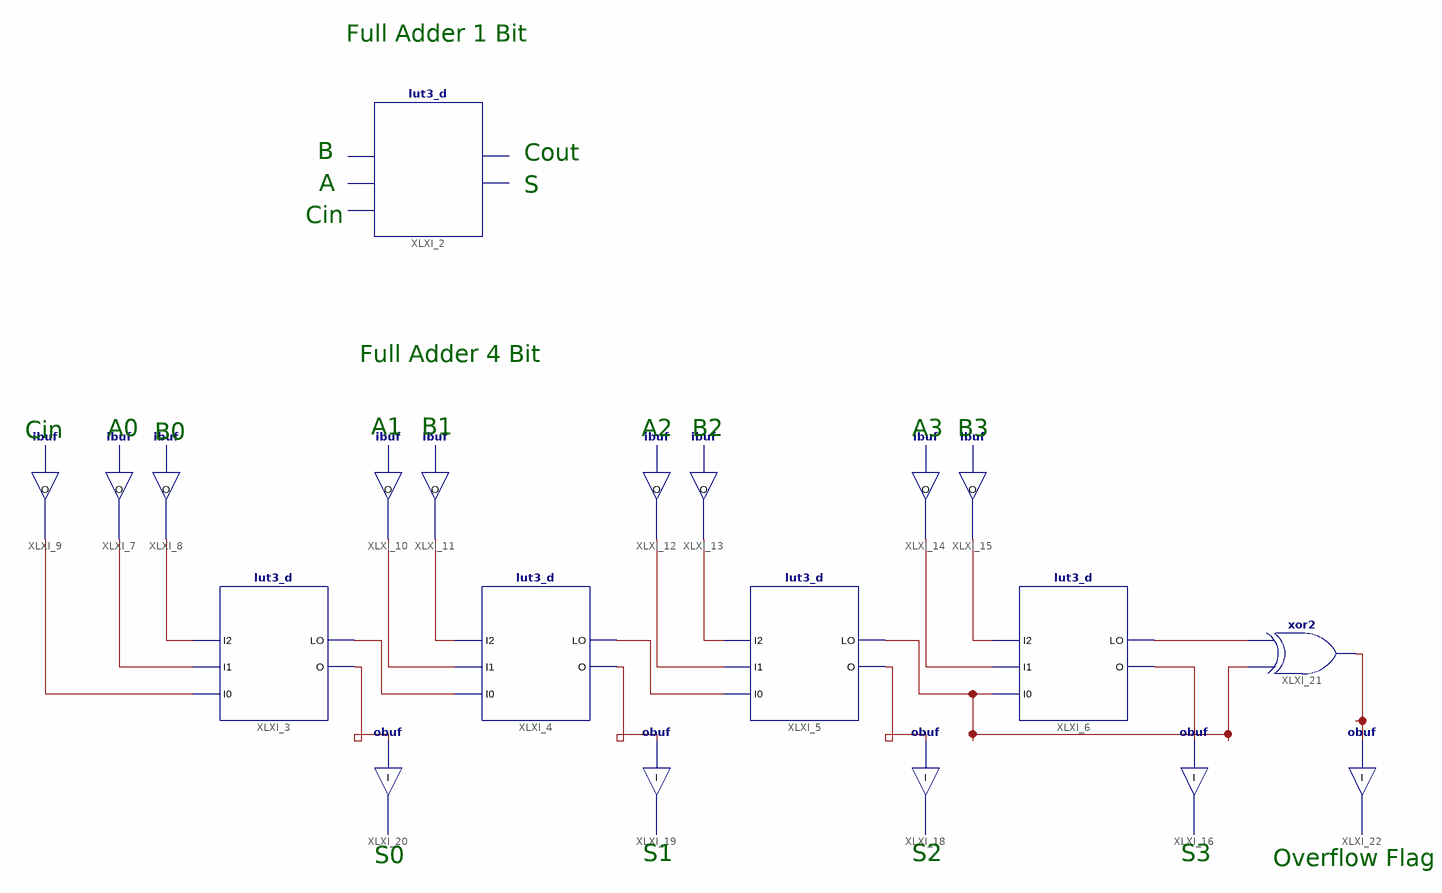
[diagram p0: schematic sheet 1]
// Xilinx ISE schematic Full_Adder_4Bi_Schematic.sch (spartan3e) as structural Verilog: 20 symbols, 0 ports
module Full_Adder_4Bi_Schematic (
);

  wire XLXN_1, XLXN_2, XLXN_3, XLXN_7, XLXN_8, XLXN_9, XLXN_10, XLXN_11, XLXN_12, XLXN_15, XLXN_17, XLXN_19,
       XLXN_20, XLXN_22, XLXN_24, XLXN_27, XLXN_28, XLXN_29;

  lut3_d XLXI_2 ();  // open: I0, I1, I2, LO, O
  lut3_d XLXI_3 (.I0(XLXN_3), .I1(XLXN_2), .I2(XLXN_1), .LO(XLXN_8), .O(XLXN_7));
  lut3_d XLXI_4 (.I0(XLXN_8), .I1(XLXN_10), .I2(XLXN_9), .LO(XLXN_15), .O(XLXN_17));
  lut3_d XLXI_5 (.I0(XLXN_15), .I1(XLXN_12), .I2(XLXN_11), .LO(XLXN_27), .O(XLXN_22));
  lut3_d XLXI_6 (.I0(XLXN_27), .I1(XLXN_20), .I2(XLXN_19), .LO(XLXN_28), .O(XLXN_24));
  ibuf XLXI_7 (.O(XLXN_2));  // open: I
  ibuf XLXI_8 (.O(XLXN_1));  // open: I
  ibuf XLXI_9 (.O(XLXN_3));  // open: I
  ibuf XLXI_10 (.O(XLXN_10));  // open: I
  ibuf XLXI_11 (.O(XLXN_9));  // open: I
  ibuf XLXI_12 (.O(XLXN_12));  // open: I
  ibuf XLXI_13 (.O(XLXN_11));  // open: I
  ibuf XLXI_14 (.O(XLXN_20));  // open: I
  ibuf XLXI_15 (.O(XLXN_19));  // open: I
  obuf XLXI_18 (.I(XLXN_22));  // open: O
  obuf XLXI_19 (.I(XLXN_17));  // open: O
  obuf XLXI_20 (.I(XLXN_7));  // open: O
  obuf XLXI_16 (.I(XLXN_24));  // open: O
  xor XLXI_21 (XLXN_29, XLXN_27, XLXN_28);
  obuf XLXI_22 (.I(XLXN_29));  // open: O

  // Notes on the sheet:
  //   Full Adder 1 Bit
  //   B
  //   Cout
  //   A
  //   S
  //   Cin
  //   Full Adder 4 Bit
  //   A1
  //   B1
  //   A0
  //   A2
  //   B2
  //   A3
  //   B3
  //   Cin
  //   B0
  //   S1
  //   S2
  //   S3
  //   S0
  //   Overflow Flag
endmodule
